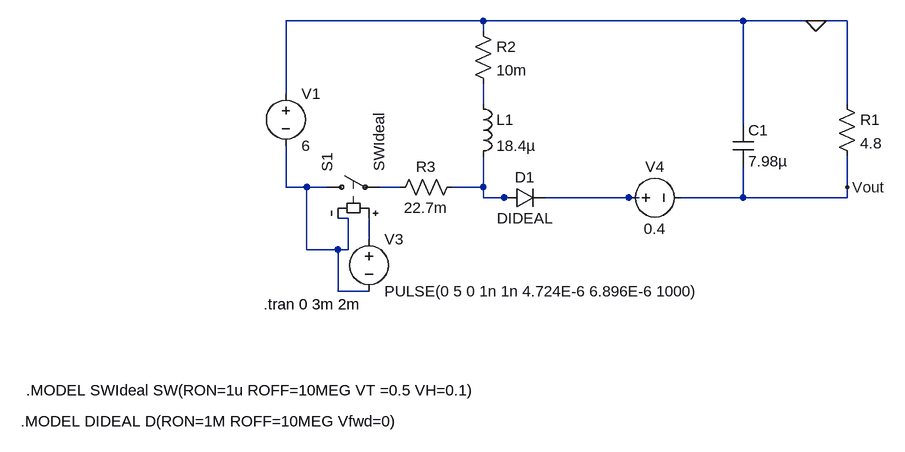
[diagram p0: schematic buck_boost.asc]
buck_boost.asc, the LTspice schematic file:
Version 4
SHEET 1 880 680
WIRE 0 -32 -304 -32
WIRE 400 -32 0 -32
WIRE 512 -32 400 -32
WIRE 560 -32 512 -32
WIRE 0 -16 0 -32
WIRE -304 80 -304 -32
WIRE 0 96 0 64
WIRE 560 96 560 -32
WIRE 400 128 400 -32
WIRE -304 224 -304 160
WIRE -272 224 -304 224
WIRE -240 224 -272 224
WIRE -128 224 -160 224
WIRE 0 224 0 176
WIRE 0 224 -48 224
WIRE 560 224 560 176
WIRE 0 240 0 224
WIRE 32 240 0 240
WIRE 48 240 32 240
WIRE 224 240 96 240
WIRE 240 240 224 240
WIRE 400 240 400 192
WIRE 400 240 304 240
WIRE 560 240 560 224
WIRE 560 240 400 240
WIRE -208 272 -224 272
WIRE -176 304 -176 272
WIRE -272 320 -272 224
WIRE -224 320 -272 320
WIRE -208 320 -208 272
WIRE -208 320 -224 320
WIRE -224 384 -224 320
WIRE -176 384 -224 384
FLAG 512 -32 0
FLAG 560 224 Vout
SYMBOL voltage -304 64 R0
WINDOW 123 0 0 Left 0
WINDOW 39 0 0 Left 0
SYMATTR InstName V1
SYMATTR Value 6
SYMBOL ind -16 80 R0
SYMATTR InstName L1
SYMATTR Value 18.4µ
SYMBOL cap 384 128 R0
SYMATTR InstName C1
SYMATTR Value 7.98µ
SYMBOL res 544 80 R0
SYMATTR InstName R1
SYMATTR Value 4.8
SYMBOL res -16 -32 R0
SYMATTR InstName R2
SYMATTR Value 10m
SYMBOL sw -256 224 R270
SYMATTR InstName S1
SYMATTR Value SWIdeal
SYMBOL res -32 208 R90
WINDOW 0 0 56 VBottom 2
WINDOW 3 32 56 VTop 2
SYMATTR InstName R3
SYMATTR Value 22.7m
SYMBOL voltage -176 288 R0
WINDOW 123 0 0 Left 0
WINDOW 39 0 0 Left 0
SYMATTR InstName V3
SYMATTR Value PULSE(0 5 0 1n 1n 4.724E-6 6.896E-6 1000)
SYMBOL voltage 208 240 R270
WINDOW 0 32 56 VTop 2
WINDOW 3 -32 56 VBottom 2
WINDOW 123 0 0 Left 0
WINDOW 39 0 0 Left 0
SYMATTR InstName V4
SYMATTR Value 0.4
SYMBOL diode 32 256 R270
WINDOW 0 32 32 VTop 2
WINDOW 3 0 32 VBottom 2
SYMATTR InstName D1
SYMATTR Value DIDEAL
TEXT -338 404 Left 2 !.tran 0 3m 2m
TEXT -704 536 Left 2 !.MODEL SWIdeal SW(RON=1u ROFF=10MEG VT =0.5 VH=0.1)
TEXT -712 584 Left 2 !.MODEL DIDEAL D(RON=1M ROFF=10MEG Vfwd=0)

The netlist it stands for:
* buck_boost.asc
V1 0 N002 6
L1 N001 N004 18.4µ
C1 0 Vout 7.98µ
R1 0 Vout 4.8
R2 0 N001 10m
S1 N002 N003 N006 N002 SWIdeal
R3 N004 N003 22.7m
V3 N006 N002 PULSE(0 5 0 1n 1n 4.724E-6 6.896E-6 1000)
V4 N005 Vout 0.4
D1 N004 N005 DIDEAL
.model D D
.lib standard.dio
.tran 0 3m 2m
.MODEL SWIdeal SW(RON=1u ROFF=10MEG VT =0.5 VH=0.1)
.MODEL DIDEAL D(RON=1M ROFF=10MEG Vfwd=0)
.backanno
.end